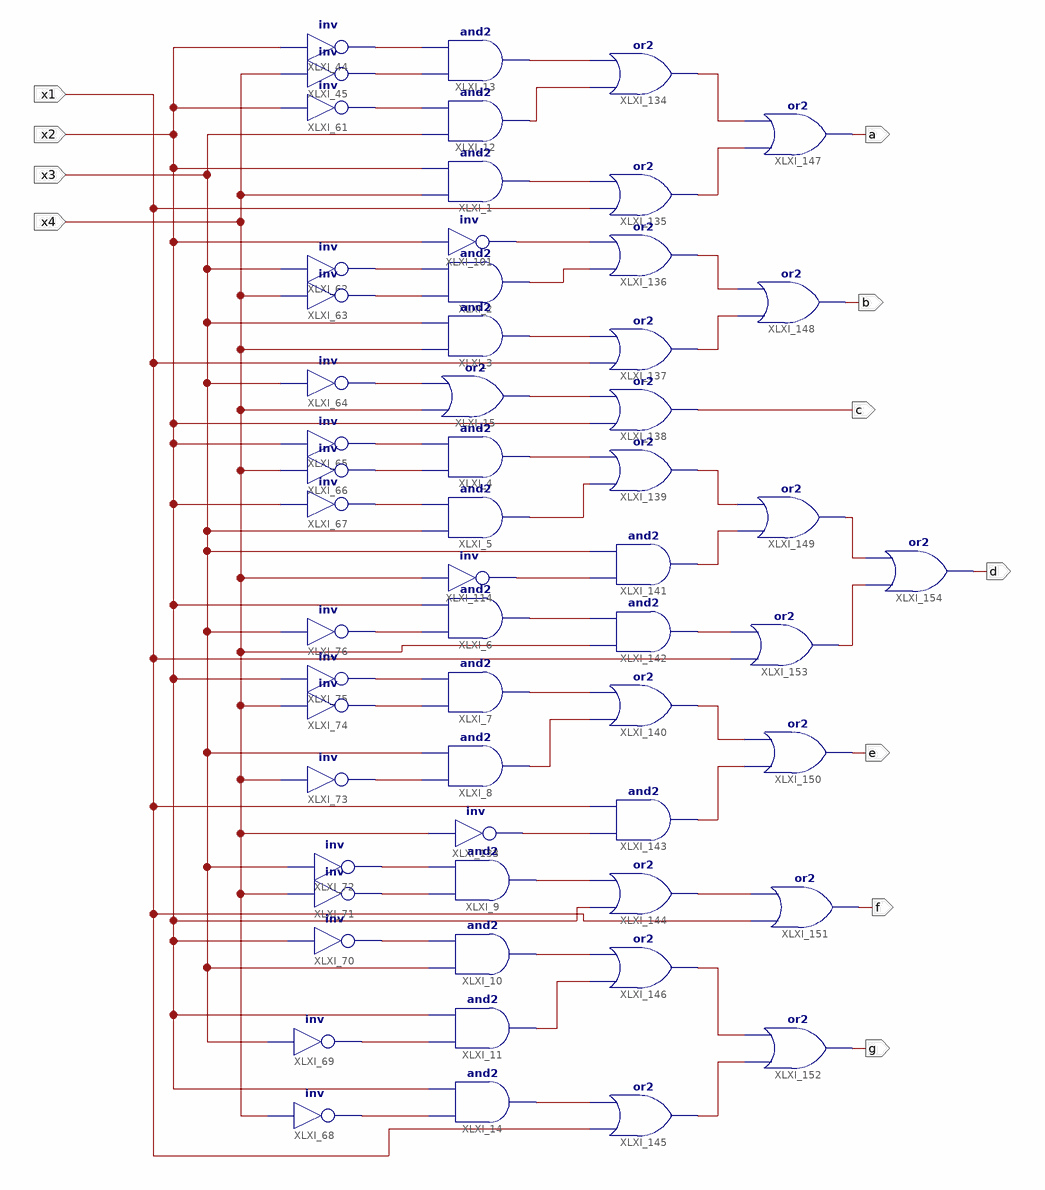
[diagram p0: schematic sheet 1]
// Xilinx ISE schematic halfadder.sch (spartan6) as structural Verilog: 57 symbols, 11 ports
module halfadder (
  input  x1,
  input  x2,
  input  x3,
  input  x4,
  output c,
  output a,
  output b,
  output d,
  output e,
  output f,
  output g
);

  wire XLXN_6, XLXN_7, XLXN_8, XLXN_9, XLXN_10, XLXN_11, XLXN_12, XLXN_13, XLXN_14, XLXN_15, XLXN_16,
       XLXN_17, XLXN_18, XLXN_19, XLXN_20, XLXN_21, XLXN_22, XLXN_23, XLXN_46, XLXN_47, XLXN_48, XLXN_49,
       XLXN_50, XLXN_51, XLXN_52, XLXN_53, XLXN_54, XLXN_55, XLXN_56, XLXN_57, XLXN_58, XLXN_59, XLXN_60,
       XLXN_61, XLXN_62, XLXN_65, XLXN_73, XLXN_74, XLXN_75, XLXN_76, XLXN_79, XLXN_80, XLXN_81, XLXN_82,
       XLXN_83, XLXN_84, XLXN_85, XLXN_86, XLXN_89, XLXN_90;

  and XLXI_2 (XLXN_59, XLXN_10, XLXN_9);
  and XLXI_3 (XLXN_58, x4, x3);
  or XLXI_15 (XLXN_57, x4, XLXN_11);
  and XLXI_4 (XLXN_56, XLXN_13, XLXN_12);
  and XLXI_5 (XLXN_55, x3, XLXN_14);
  and XLXI_6 (XLXN_53, XLXN_15, x2);
  and XLXI_7 (XLXN_51, XLXN_17, XLXN_16);
  and XLXI_8 (XLXN_52, XLXN_18, x3);
  not XLXI_62 (XLXN_9, x3);
  not XLXI_63 (XLXN_10, x4);
  not XLXI_64 (XLXN_11, x3);
  not XLXI_65 (XLXN_12, x2);
  not XLXI_66 (XLXN_13, x4);
  not XLXI_67 (XLXN_14, x2);
  not XLXI_76 (XLXN_15, x3);
  not XLXI_75 (XLXN_16, x2);
  not XLXI_74 (XLXN_17, x4);
  not XLXI_73 (XLXN_18, x4);
  not XLXI_101 (XLXN_60, x2);
  and XLXI_13 (XLXN_62, XLXN_7, XLXN_6);
  and XLXI_12 (XLXN_65, x3, XLXN_8);
  and XLXI_1 (XLXN_61, x4, x2);
  not XLXI_61 (XLXN_8, x2);
  not XLXI_45 (XLXN_7, x4);
  not XLXI_44 (XLXN_6, x2);
  not XLXI_114 (XLXN_54, x4);
  and XLXI_9 (XLXN_49, XLXN_19, XLXN_20);
  and XLXI_10 (XLXN_48, x3, XLXN_21);
  and XLXI_11 (XLXN_47, XLXN_22, x2);
  and XLXI_14 (XLXN_46, XLXN_23, x2);
  not XLXI_68 (XLXN_23, x4);
  not XLXI_69 (XLXN_22, x3);
  not XLXI_70 (XLXN_21, x2);
  not XLXI_71 (XLXN_19, x4);
  not XLXI_72 (XLXN_20, x3);
  not XLXI_133 (XLXN_50, x4);
  or XLXI_134 (XLXN_73, XLXN_65, XLXN_62);
  or XLXI_135 (XLXN_74, x1, XLXN_61);
  or XLXI_136 (XLXN_75, XLXN_59, XLXN_60);
  or XLXI_137 (XLXN_76, x1, XLXN_58);
  or XLXI_138 (c, x2, XLXN_57);
  or XLXI_139 (XLXN_85, XLXN_55, XLXN_56);
  or XLXI_140 (XLXN_82, XLXN_52, XLXN_51);
  and XLXI_141 (XLXN_84, XLXN_54, x3);
  and XLXI_142 (XLXN_86, x4, XLXN_53);
  and XLXI_143 (XLXN_83, XLXN_50, x1);
  or XLXI_144 (XLXN_81, x2, XLXN_49);
  or XLXI_145 (XLXN_80, x1, XLXN_46);
  or XLXI_146 (XLXN_79, XLXN_47, XLXN_48);
  or XLXI_147 (a, XLXN_74, XLXN_73);
  or XLXI_148 (b, XLXN_76, XLXN_75);
  or XLXI_149 (XLXN_89, XLXN_84, XLXN_85);
  or XLXI_150 (e, XLXN_83, XLXN_82);
  or XLXI_151 (f, x1, XLXN_81);
  or XLXI_152 (g, XLXN_80, XLXN_79);
  or XLXI_153 (XLXN_90, x1, XLXN_86);
  or XLXI_154 (d, XLXN_90, XLXN_89);
endmodule
